# Altium project USB.PrjPCB
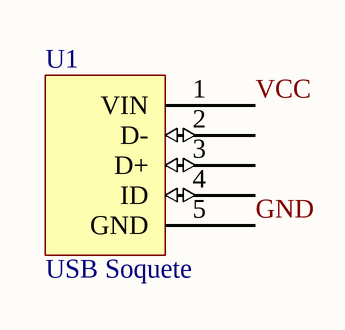
[diagram p0: Esquematico.SchDoc]
1 sheet, 1 parts. Net scope: global (net labels, ports and power ports of the same name join across sheets).
Board file: PCB.PcbDoc

## Sheet Esquematico.SchDoc
size A4

### Parts
U1  USB Soquete  [USB]

### Nets
GND: U1.5(GND)
VCC: U1.1(VIN)

Not connected (* = marked no-connect by the designer): U1 2(D-) 3(D+) 4(ID)